# EAGLE design panel (EAGLE 9.6.2)

## Sheet 1 of 2
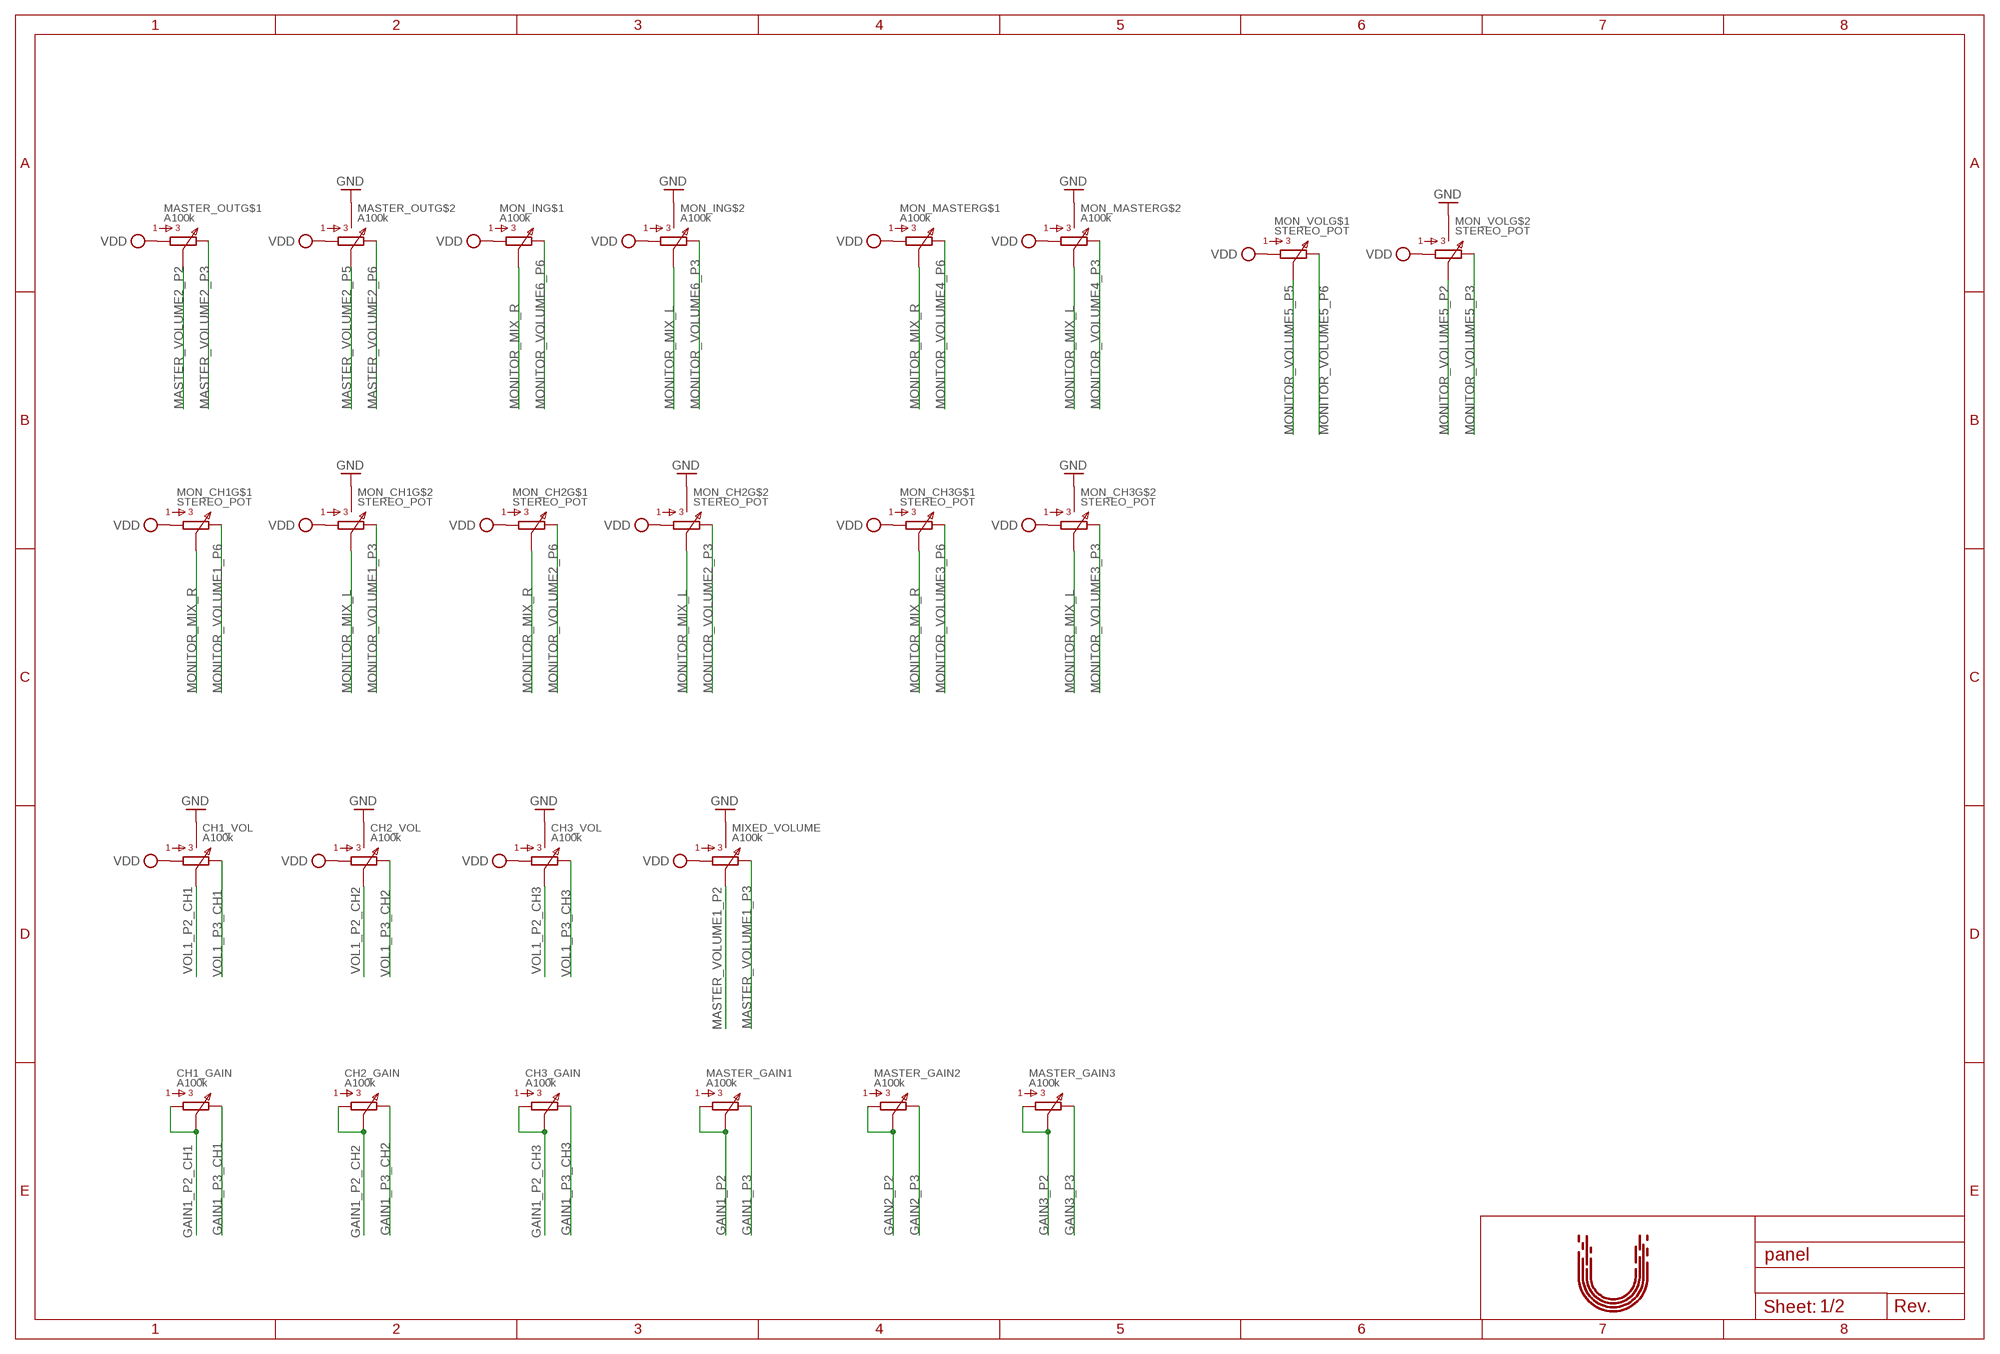
[diagram p0: schematic, sheet 1]

### Parts
CH1_GAIN  A100k  TRIMPOT  [3296W]
CH1_VOL  A100k  POT  [P0915N]
CH2_GAIN  A100k  TRIMPOT  [3296W]
CH2_VOL  A100k  POT  [P0915N]
CH3_GAIN  A100k  TRIMPOT  [3296W]
CH3_VOL  A100k  POT  [P0915N]
MASTER_GAIN1  A100k  TRIMPOT  [3296W]
MASTER_GAIN2  A100k  TRIMPOT  [3296W]
MASTER_GAIN3  A100k  TRIMPOT  [3296W]
MASTER_OUT  A100k  STEREO_POT  [P0925N]
MIXED_VOLUME  A100k  POT  [P0915N]
MON_CH1  STEREO_POT  [P0925N]
MON_CH2  STEREO_POT  [P0925N]
MON_CH3  STEREO_POT  [P0925N]
MON_IN  A100k  STEREO_POT  [P0925N]
MON_MASTER  A100k  STEREO_POT  [P0925N]
MON_VOL  STEREO_POT  [P0925N]
U$1  UTBULT_DESIGN4  [UD_4]

### Nets
GAIN1_P2: MASTER_GAIN1.P$1 MASTER_GAIN1.P$2 ; also sheet 2
GAIN1_P2_CH1: CH1_GAIN.P$1 CH1_GAIN.P$2 ; also sheet 2
GAIN1_P2_CH2: CH2_GAIN.P$1 CH2_GAIN.P$2 ; also sheet 2
GAIN1_P2_CH3: CH3_GAIN.P$1 CH3_GAIN.P$2 ; also sheet 2
GAIN1_P3: MASTER_GAIN1.P$3 ; also sheet 2
GAIN1_P3_CH1: CH1_GAIN.P$3 ; also sheet 2
GAIN1_P3_CH2: CH2_GAIN.P$3 ; also sheet 2
GAIN1_P3_CH3: CH3_GAIN.P$3 ; also sheet 2
GAIN2_P2: MASTER_GAIN2.P$1 MASTER_GAIN2.P$2 ; also sheet 2
GAIN2_P3: MASTER_GAIN2.P$3 ; also sheet 2
GAIN3_P2: MASTER_GAIN3.P$1 MASTER_GAIN3.P$2 ; also sheet 2
GAIN3_P3: MASTER_GAIN3.P$3 ; also sheet 2
GND: CH1_VOL.P$7 CH1_VOL.P$8 CH2_VOL.P$7 CH2_VOL.P$8 CH3_VOL.P$7 CH3_VOL.P$8 MASTER_OUT.P$7 MASTER_OUT.P$8 MIXED_VOLUME.P$7 MIXED_VOLUME.P$8 MON_CH1.P$7 MON_CH1.P$8 MON_CH2.P$7 MON_CH2.P$8 MON_CH3.P$7 MON_CH3.P$8 MON_IN.P$7 MON_IN.P$8 MON_MASTER.P$7 MON_MASTER.P$8 MON_VOL.P$7 MON_VOL.P$8 ; also sheet 2
MASTER_VOLUME1_P2: MIXED_VOLUME.P$2 ; also sheet 2
MASTER_VOLUME1_P3: MIXED_VOLUME.P$3 ; also sheet 2
MASTER_VOLUME2_P2: MASTER_OUT.P$2 ; also sheet 2
MASTER_VOLUME2_P3: MASTER_OUT.P$3 ; also sheet 2
MASTER_VOLUME2_P5: MASTER_OUT.P$5 ; also sheet 2
MASTER_VOLUME2_P6: MASTER_OUT.P$6 ; also sheet 2
MONITOR_MIX_L: MON_CH1.P$5 MON_CH2.P$5 MON_CH3.P$5 MON_IN.P$5 MON_MASTER.P$5 ; also sheet 2
MONITOR_MIX_R: MON_CH1.P$2 MON_CH2.P$2 MON_CH3.P$2 MON_IN.P$2 MON_MASTER.P$2 ; also sheet 2
MONITOR_VOLUME1_P3: MON_CH1.P$6 ; also sheet 2
MONITOR_VOLUME1_P6: MON_CH1.P$3 ; also sheet 2
MONITOR_VOLUME2_P3: MON_CH2.P$6 ; also sheet 2
MONITOR_VOLUME2_P6: MON_CH2.P$3 ; also sheet 2
MONITOR_VOLUME3_P3: MON_CH3.P$6 ; also sheet 2
MONITOR_VOLUME3_P6: MON_CH3.P$3 ; also sheet 2
MONITOR_VOLUME4_P3: MON_MASTER.P$6 ; also sheet 2
MONITOR_VOLUME4_P6: MON_MASTER.P$3 ; also sheet 2
MONITOR_VOLUME5_P2: MON_VOL.P$5 ; also sheet 2
MONITOR_VOLUME5_P3: MON_VOL.P$6 ; also sheet 2
MONITOR_VOLUME5_P5: MON_VOL.P$2 ; also sheet 2
MONITOR_VOLUME5_P6: MON_VOL.P$3 ; also sheet 2
MONITOR_VOLUME6_P3: MON_IN.P$6 ; also sheet 2
MONITOR_VOLUME6_P6: MON_IN.P$3 ; also sheet 2
VDD: CH1_VOL.P$1 CH2_VOL.P$1 CH3_VOL.P$1 MASTER_OUT.P$1 MASTER_OUT.P$4 MIXED_VOLUME.P$1 MON_CH1.P$1 MON_CH1.P$4 MON_CH2.P$1 MON_CH2.P$4 MON_CH3.P$1 MON_CH3.P$4 MON_IN.P$1 MON_IN.P$4 MON_MASTER.P$1 MON_MASTER.P$4 MON_VOL.P$1 MON_VOL.P$4 ; also sheet 2
VOL1_P2_CH1: CH1_VOL.P$2 ; also sheet 2
VOL1_P2_CH2: CH2_VOL.P$2 ; also sheet 2
VOL1_P2_CH3: CH3_VOL.P$2 ; also sheet 2
VOL1_P3_CH1: CH1_VOL.P$3 ; also sheet 2
VOL1_P3_CH2: CH2_VOL.P$3 ; also sheet 2
VOL1_P3_CH3: CH3_VOL.P$3 ; also sheet 2

## Sheet 2 of 2: Headers
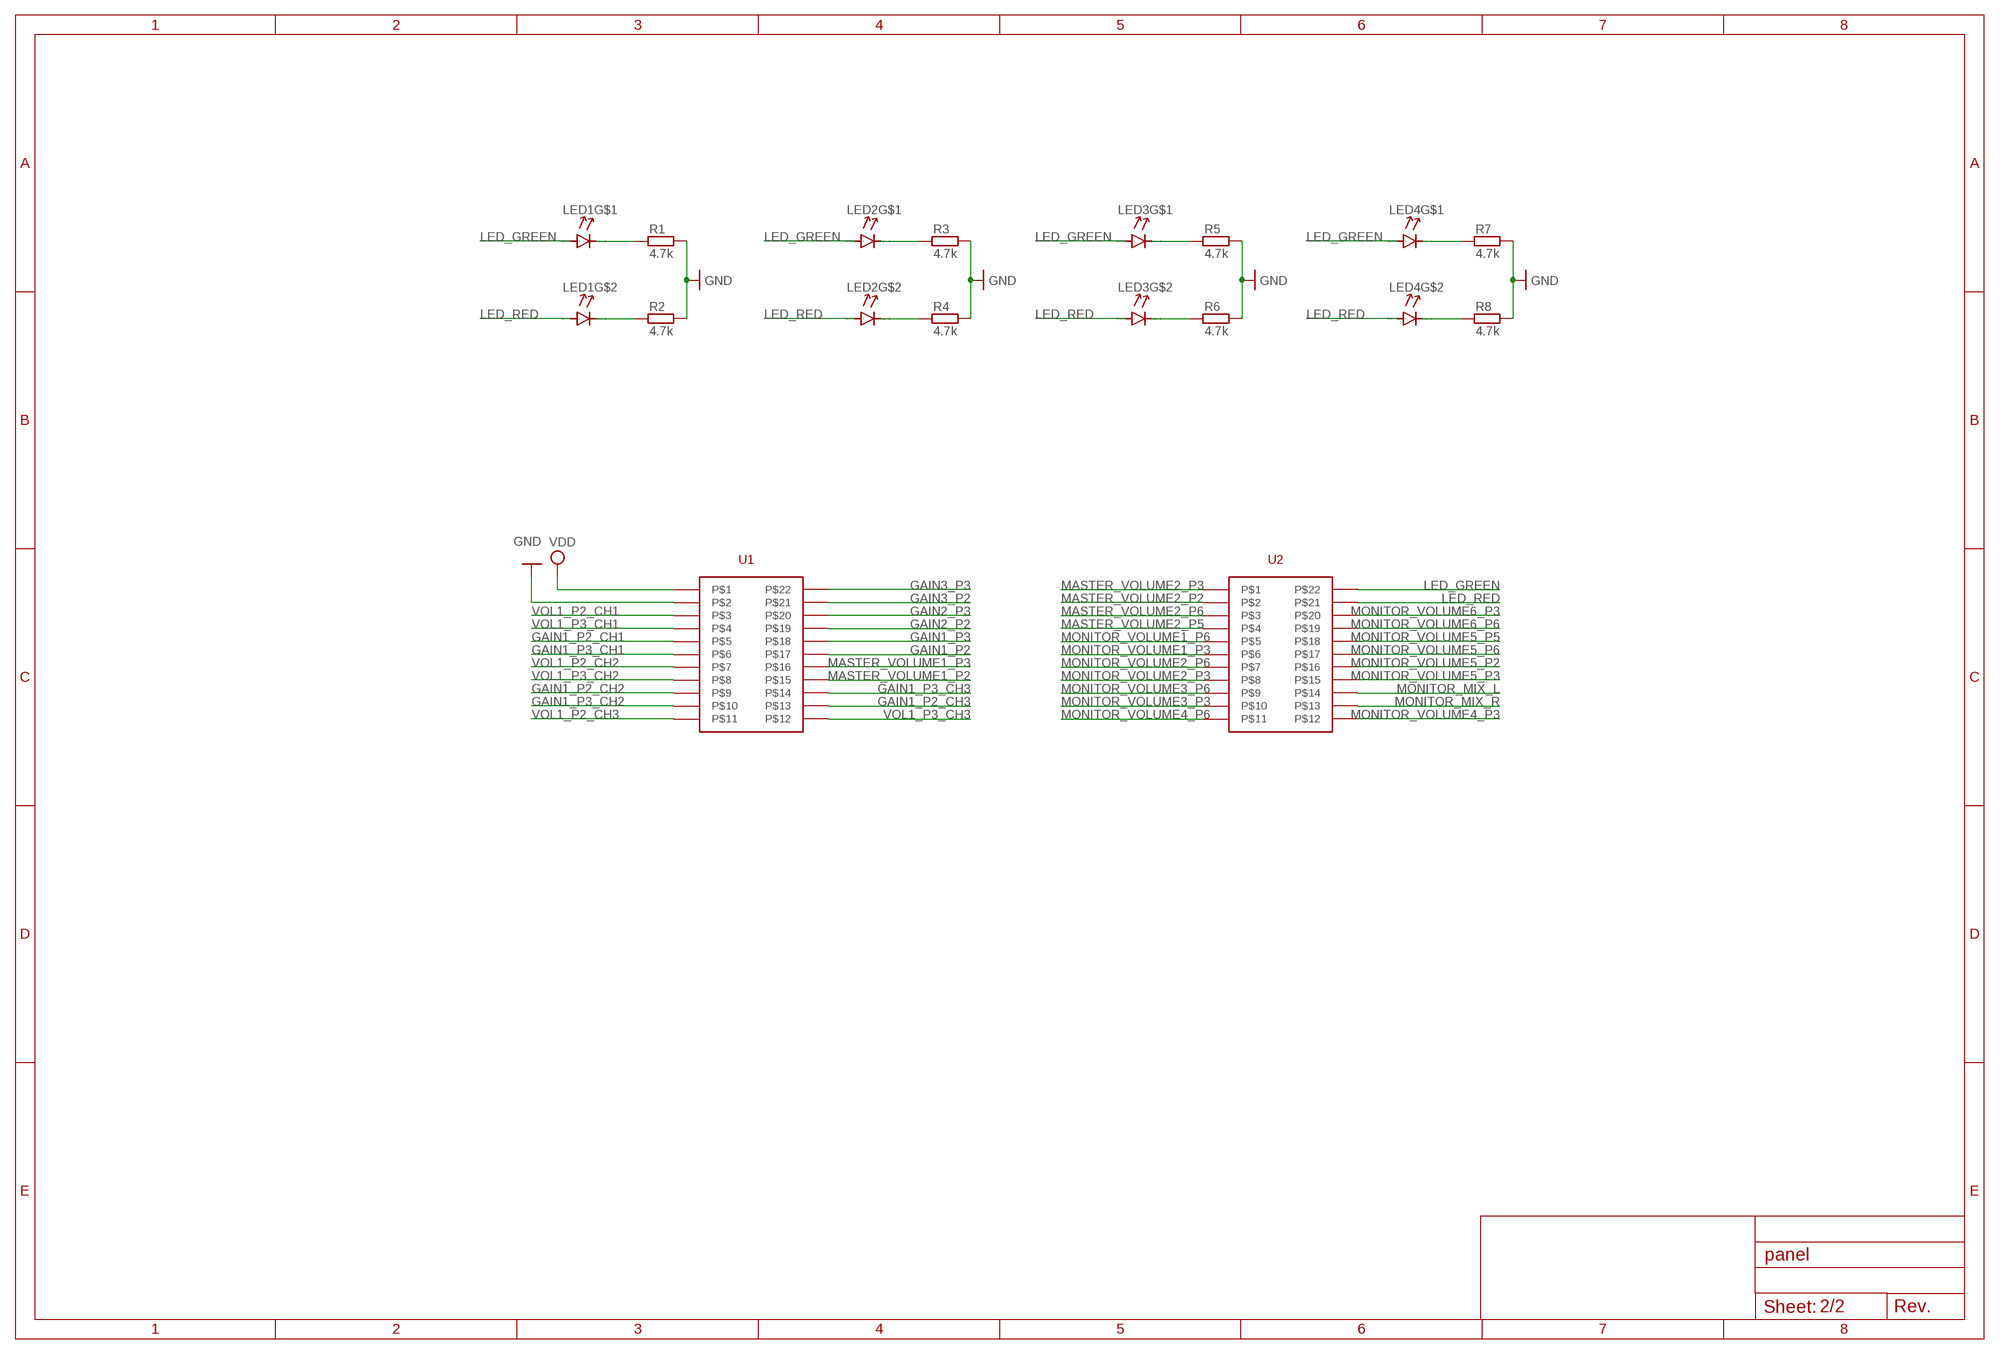
[diagram p1: schematic, sheet 2]

### Parts
LED1  DUAL_LEDDUAL_LED  [RESCAXE40P80X160X50-4N]
LED2  DUAL_LEDDUAL_LED  [RESCAXE40P80X160X50-4N]
LED3  DUAL_LEDDUAL_LED  [RESCAXE40P80X160X50-4N]
LED4  DUAL_LEDDUAL_LED  [RESCAXE40P80X160X50-4N]
R1  4.7k  RESISTOR  [R0603]
R2  4.7k  RESISTOR  [R0603]
R3  4.7k  RESISTOR  [R0603]
R4  4.7k  RESISTOR  [R0603]
R5  4.7k  RESISTOR  [R0603]
R6  4.7k  RESISTOR  [R0603]
R7  4.7k  RESISTOR  [R0603]
R8  4.7k  RESISTOR  [R0603]
U1  22PINHEADER22PINHEADER  [HDRV22W64P254_2X11_2794X508X838B]
U2  22PINHEADER22PINHEADER  [HDRV22W64P254_2X11_2794X508X838B]

### Nets
GAIN1_P2: U1.17 ; also sheet 1
GAIN1_P2_CH1: U1.5 ; also sheet 1
GAIN1_P2_CH2: U1.9 ; also sheet 1
GAIN1_P2_CH3: U1.13 ; also sheet 1
GAIN1_P3: U1.18 ; also sheet 1
GAIN1_P3_CH1: U1.6 ; also sheet 1
GAIN1_P3_CH2: U1.10 ; also sheet 1
GAIN1_P3_CH3: U1.14 ; also sheet 1
GAIN2_P2: U1.19 ; also sheet 1
GAIN2_P3: U1.20 ; also sheet 1
GAIN3_P2: U1.21 ; also sheet 1
GAIN3_P3: U1.22 ; also sheet 1
GND: R1.2 R2.2 R3.2 R4.2 R5.2 R6.2 R7.2 R8.2 U1.2 ; also sheet 1
LED_GREEN: LED1.1(A) LED2.1(A) LED3.1(A) LED4.1(A) U2.22
LED_RED: LED1.2(A) LED2.2(A) LED3.2(A) LED4.2(A) U2.21
MASTER_VOLUME1_P2: U1.15 ; also sheet 1
MASTER_VOLUME1_P3: U1.16 ; also sheet 1
MASTER_VOLUME2_P2: U2.2 ; also sheet 1
MASTER_VOLUME2_P3: U2.1 ; also sheet 1
MASTER_VOLUME2_P5: U2.4 ; also sheet 1
MASTER_VOLUME2_P6: U2.3 ; also sheet 1
MONITOR_MIX_L: U2.14 ; also sheet 1
MONITOR_MIX_R: U2.13 ; also sheet 1
MONITOR_VOLUME1_P3: U2.6 ; also sheet 1
MONITOR_VOLUME1_P6: U2.5 ; also sheet 1
MONITOR_VOLUME2_P3: U2.8 ; also sheet 1
MONITOR_VOLUME2_P6: U2.7 ; also sheet 1
MONITOR_VOLUME3_P3: U2.10 ; also sheet 1
MONITOR_VOLUME3_P6: U2.9 ; also sheet 1
MONITOR_VOLUME4_P3: U2.12 ; also sheet 1
MONITOR_VOLUME4_P6: U2.11 ; also sheet 1
MONITOR_VOLUME5_P2: U2.16 ; also sheet 1
MONITOR_VOLUME5_P3: U2.15 ; also sheet 1
MONITOR_VOLUME5_P5: U2.18 ; also sheet 1
MONITOR_VOLUME5_P6: U2.17 ; also sheet 1
MONITOR_VOLUME6_P3: U2.20 ; also sheet 1
MONITOR_VOLUME6_P6: U2.19 ; also sheet 1
N$1: LED1.4(C) R1.1
N$2: LED1.3(C) R2.1
N$3: LED2.4(C) R3.1
N$4: LED2.3(C) R4.1
N$5: LED3.4(C) R5.1
N$6: LED3.3(C) R6.1
N$7: LED4.4(C) R7.1
N$8: LED4.3(C) R8.1
VDD: U1.1 ; also sheet 1
VOL1_P2_CH1: U1.3 ; also sheet 1
VOL1_P2_CH2: U1.7 ; also sheet 1
VOL1_P2_CH3: U1.11 ; also sheet 1
VOL1_P3_CH1: U1.4 ; also sheet 1
VOL1_P3_CH2: U1.8 ; also sheet 1
VOL1_P3_CH3: U1.12 ; also sheet 1

## Library data of the parts
CH1_GAIN CH2_GAIN CH3_GAIN MASTER_GAIN1-MASTER_GAIN3 = lib:TRIMPOT: Trim pot Trimmer Resistors - Through Hole 3/8" 100Kohms Sealed Vertical Adjust; LINK: https://www.mouser.se/ProductDetail/Bourns/3296W-1-104RLF?qs=L51TDuM0cPDJlywbd0t8jQ%3D%3D; MOUSERNR: 652-3296W-1-104RLF; MPN: 3296W-1-104RLF; SUPPLIER: Mouser
CH1_VOL CH2_VOL CH3_VOL MIXED_VOLUME = lib:POT: Potentiometer Potentiometers 1/40W 100K Ohms 20% 9mm ROTARY POT; LINK: https://www.mouser.se/ProductDetail/BI-Technologies-TT-Electronics/P0915N-QC15AR100K?qs=xIkB7y1OTopi6Zs8qG7IZg%3D%3D; MOUSERNR: 858-P0915NQC15AR100K; MPN: P0915N-QC15AR100K; SUPPLIER: Mouser
LED1-LED4 = lib:DUAL_LED: Dual Led Standard LEDs - SMD Red/Amber Bi-Color; LINK: https://www.mouser.se/ProductDetail/Broadcom-Avago/HSMF-C162?qs=9%2FrGSQZ%252Bqoid0PR%252B7Tavrg%3D%3D; MOUSERNR: 630-HSMF-C162; MPN: HSMF-C162; SUPPLIER: Mouser
MASTER_OUT MON_CH1-MON_CH3 MON_IN MON_MASTER MON_VOL = lib:STEREO_POT: Stereo Pot Potentiometers 1/40W 100K Ohms 20% 9mm ROTARY POT; LINK: https://www.mouser.se/ProductDetail/BI-Technologies-TT-Electronics/P0925N-FC20AR100K?qs=56eeD6vBg8iu%252BaH%2FeiwqGQ%3D%3D; MOUSERNR: 858-P0925NFC20AR100K; MPN: P0925N-FC20AR100K; SUPPLIER: Mouser
R1-R8 = lib:RESISTOR
U1 U2 = lib:22PINHEADER
U$1 = lib:UTBULT_DESIGN

## Board
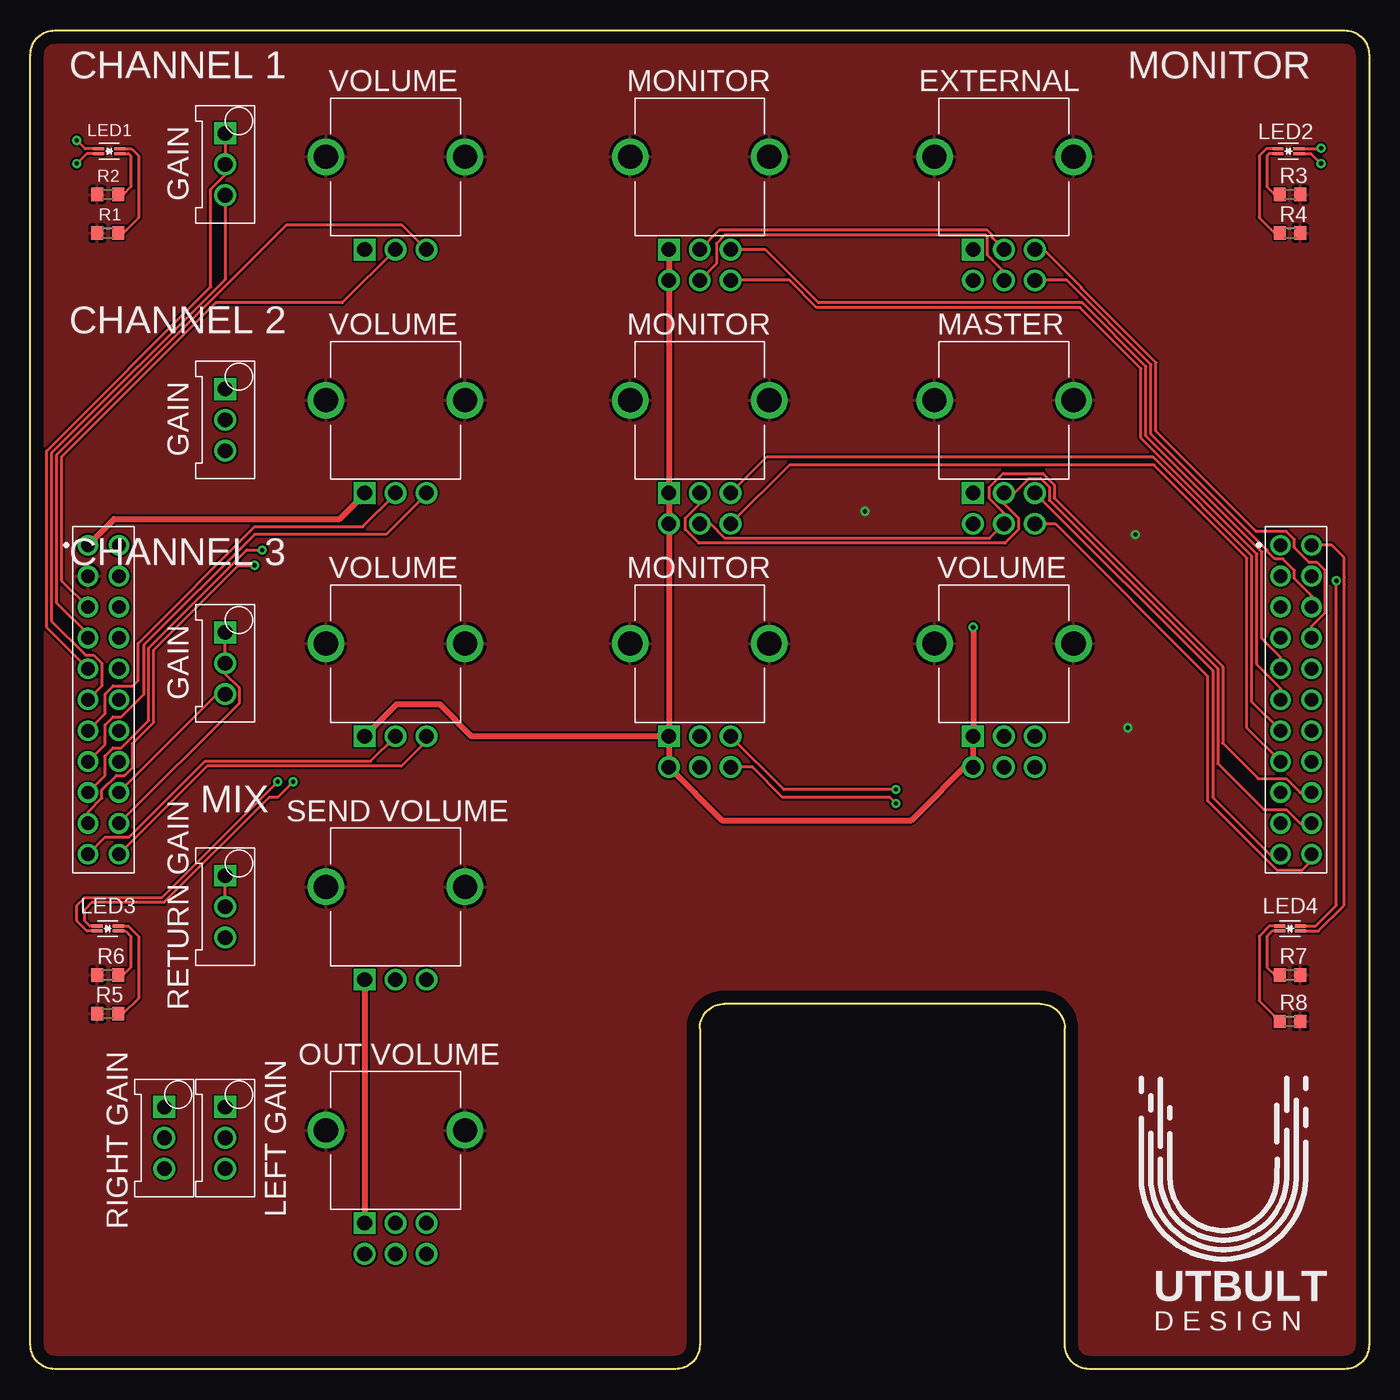
[diagram p2: board, top side]
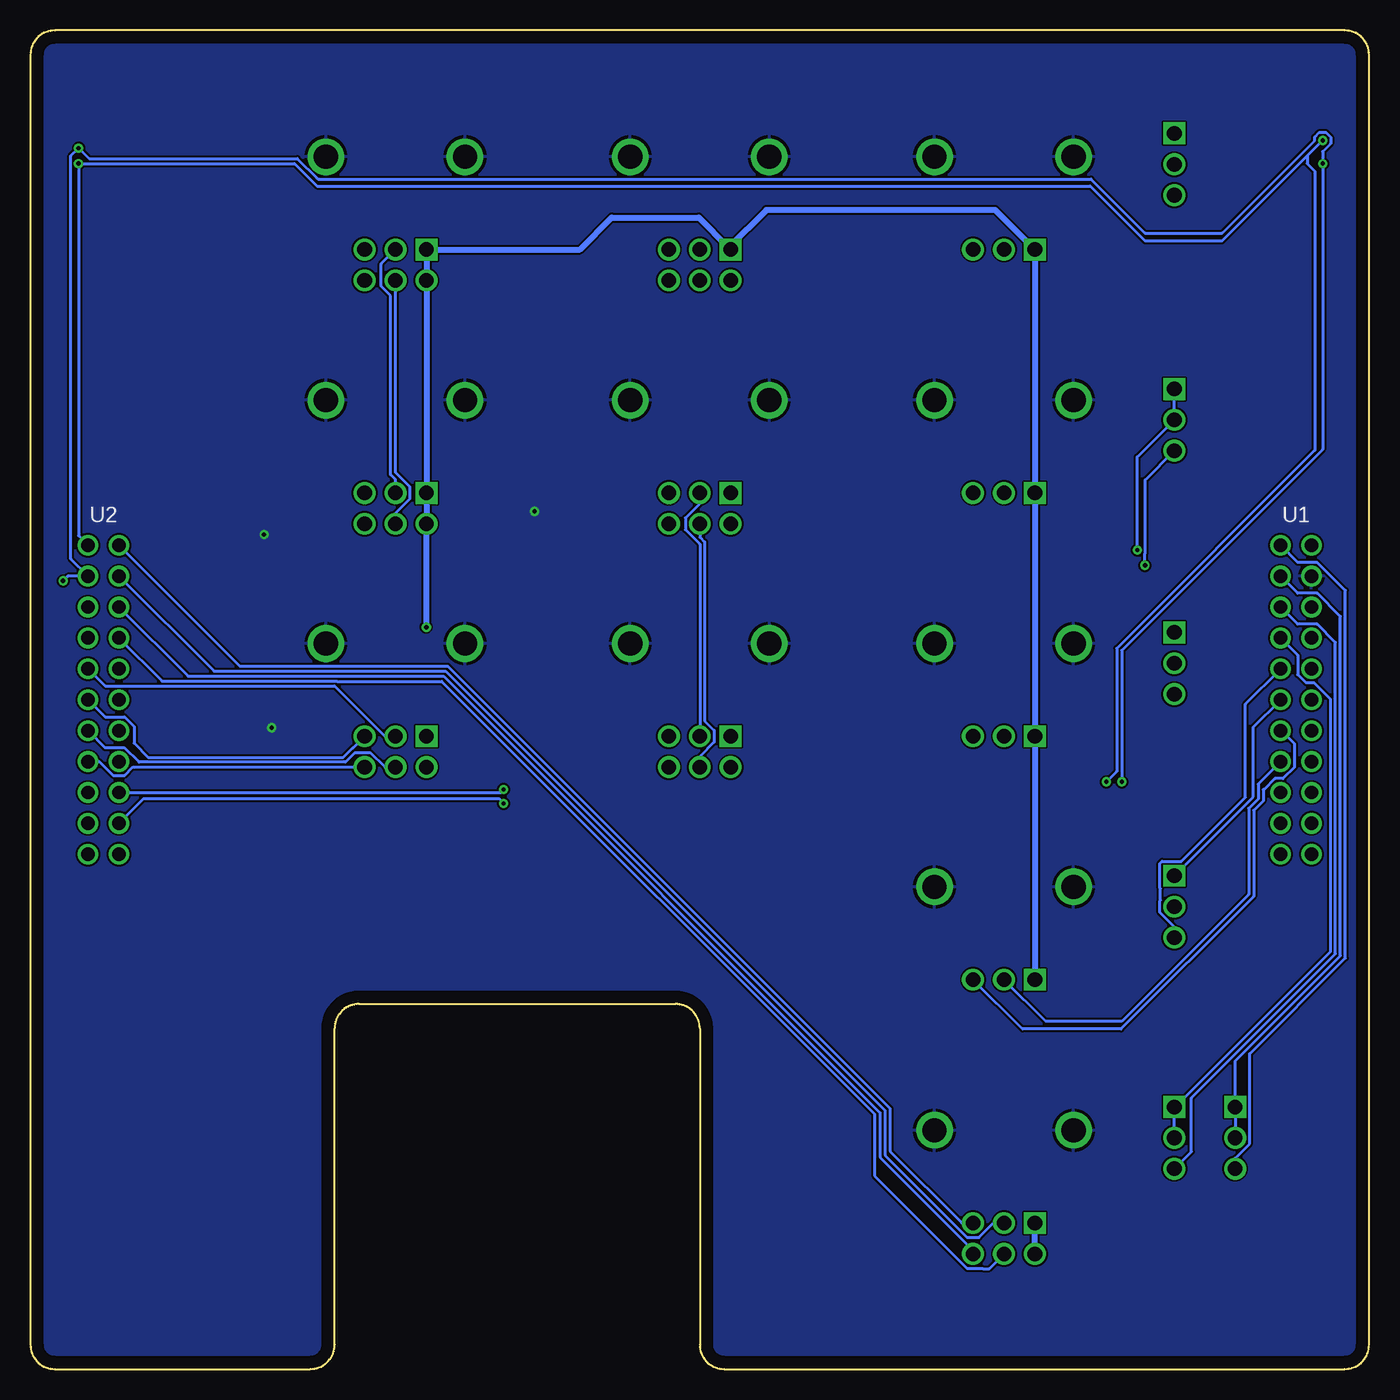
[diagram p3: board, bottom side, seen from below]

Size 110 x 110 mm. Coordinates in mm from the lower left corner, seen from the top.
Outline: 0,2 0,108 arc-90 2,110 108,110 arc-90 110,108 110,2 arc-90 108,0 87,0 arc-90 85,2 85,28 arc90 83,30 57,30 arc90 55,28 55,2 arc-90 53,0 2,0 arc-90 0,2
Copper layers (1*16): Top 0.035mm / dielectric 1.5mm / Bottom 0.035mm
Design rules "default": minimum track width 6mil, minimum drill 0.35mm, track to track 6mil, track to pad 6mil, pad to pad 6mil, via to via 6mil, smd to smd 6mil, copper to edge 40mil, drill to drill 6mil, minimum pad ring 10mil, minimum via ring 8mil, stop-mask expansion 4mil, vias tented up to drill 0mil, thermal gap 10mil

### Footprints (pad centres in the part's own frame; a part is rotated, then mirrored left to right if it is on the bottom)
3296W = drill 1.2 square: P$1 -2.54,0 | drill 1.2: P$2 0,0; P$3 2.54,0
P0915N = drill 1.2 square: P$1 -2.54,0 | drill 1.2: P$2 0,0; P$3 2.54,0 | drill 2: P$7 -5.715,7.62; P$8 5.715,7.62
RESCAXE40P80X160X50-4N = smd 0.89 x 0.26: 1 -0.855,0.2; 2 -0.855,-0.2; 3 0.855,-0.2; 4 0.855,0.2
P0925N = drill 1.2 square: P$1 -2.54,0 | drill 1.2: P$2 0,0; P$3 2.54,0; P$4 -2.54,-2.54; P$5 0,-2.54; P$6 2.54,-2.54 | drill 2: P$7 -5.715,7.62; P$8 5.715,7.62
R0603 = smd 1 x 1.1: 1 -0.85,0; 2 0.85,0
HDRV22W64P254_2X11_2794X508X838B = drill 1.105 pad 1.705: 1 -12.7,-1.27; 2 -10.16,-1.27; 3 -7.62,-1.27; 4 -5.08,-1.27; 5 -2.54,-1.27; 6 0,-1.27; 7 2.54,-1.27; 8 5.08,-1.27; 9 7.62,-1.27; 10 10.16,-1.27; 11 12.7,-1.27; 12 12.7,1.27; 13 10.16,1.27; 14 7.62,1.27; 15 5.08,1.27; 16 2.54,1.27; 17 0,1.27; 18 -2.54,1.27; 19 -5.08,1.27; 20 -7.62,1.27; 21 -10.16,1.27; 22 -12.7,1.27

### Placement (x,y rotation side)
CH1_GAIN  16,99 270 top
CH1_VOL  30,92 0 top
CH2_GAIN  16,78 270 top
CH2_VOL  30,72 0 top
CH3_GAIN  16,58 270 top
CH3_VOL  30,52 0 top
LED1  6.48,100.08 0 top
LED2  103.38,100.08 180 top
LED3  6.35,36.2 0 top
LED4  103.5,36.2 180 top
MASTER_GAIN1  16,38 270 top
MASTER_GAIN2  16,19 270 top
MASTER_GAIN3  11,19 270 top
MASTER_OUT  30,12 0 top
MIXED_VOLUME  30,32 0 top
MON_CH1  55,92 0 top
MON_CH2  55,72 0 top
MON_CH3  55,52 0 top
MON_IN  80,92 0 top
MON_MASTER  80,72 0 top
MON_VOL  80,52 0 top
R1  6.35,93.34 180 top
R2  6.35,96.52 180 top
R3  103.5,96.52 0 top
R4  103.5,93.34 0 top
R5  6.35,29.21 180 top
R6  6.35,32.38 180 top
R7  103.5,32.38 0 top
R8  103.5,28.57 0 top
U1  6,55 270 top
U2  104,55 270 top
U$1  98,17 0 top

### Tracks (layer width: path | path; a pad name or v marks a point on that pad's centre or on a via)
GAIN1_P2
  Top 0.254: MASTER_GAIN1.P$2 MASTER_GAIN1.P$1
  Bottom 0.254: MASTER_GAIN1.P$1 9.53,47.02 9.53,52.74 U1.17
GAIN1_P2_CH1
  Top 0.254: CH1_GAIN.P$1 CH1_GAIN.P$2 16,98.13 14.82,96.95 14.82,88.94 1.32,75.44 1.32,60.95 U1.5
GAIN1_P2_CH2  (via drill 0.35)
  Top 0.254: U1.9 6.14,48.79 6.14,50.39 6.8,51.05 7.46,51.05 9.73,53.32 9.73,59.26 17.78,67.31 v19.05,67.31
  Bottom 0.254: v19.05,67.31 19.05,74.95 CH2_GAIN.P$2 CH2_GAIN.P$1
GAIN1_P2_CH3
  Top 0.254: U1.13 17.18,54.75 17.18,55.95 16,57.13 CH3_GAIN.P$2 CH3_GAIN.P$1
GAIN1_P3
  Bottom 0.254: MASTER_GAIN1.P$3 16,36.33 17.18,37.51 17.18,38.49 17.14,38.52 17.14,39.49 17.18,39.52 17.18,41.56 17.02,41.72 15.43,41.72 10.16,46.99 10.16,54.65 U1.18
GAIN1_P3_CH1
  Top 0.254: CH1_GAIN.P$3 16,89.54 1.73,75.27 1.73,61.48 4.54,58.67 5.2,58.67 5.86,58.01 5.86,56.13 U1.6
GAIN1_P3_CH2  (via drill 0.35)
  Top 0.254: U1.10 4.73,45.78 5.86,46.91 5.86,47.57 7.08,48.79 7.74,48.79 8.4,49.45 8.4,51.42 10.13,53.15 10.13,59.09 17.09,66.04 v18.41,66.04
  Bottom 0.254: v18.41,66.04 18.41,67.02 18.39,67.04 18.39,73.07 CH2_GAIN.P$3
GAIN1_P3_CH3
  Top 0.254: U1.14 15.35,55.46 CH3_GAIN.P$3
GAIN2_P2
  Bottom 0.254: U1.19 5.86,58.67 5.86,57.07 5.2,56.41 4.54,56.41 3.17,55.05 3.17,34.29 16.51,20.95 16.51,21.03 16.23,21.31 | 16.23,21.31 MASTER_GAIN2.P$1 | MASTER_GAIN2.P$2 16,21.08 16.23,21.31
GAIN2_P3
  Bottom 0.254: MASTER_GAIN2.P$3 14.61,17.86 14.61,22.29 2.77,34.12 2.77,59.72 4.26,61.21 5.86,61.21 U1.20
GAIN3_P2
  Bottom 0.254: MASTER_GAIN3.P$2 MASTER_GAIN3.P$1 11,25.32 2.36,33.95 2.36,61.85 4.26,63.75 5.86,63.75 U1.21
GAIN3_P3
  Bottom 0.254: MASTER_GAIN3.P$3 11,17.33 9.82,18.51 9.82,25.92 1.96,33.78 1.96,63.99 4.26,66.29 5.86,66.29 U1.22
GND  (via drill 0.35)
  other vias: 68.58,70.48 90.81,68.58 90.17,52.7
  pour Bottom: 0,110.49 109.86,110.49 109.86,0 0,0
  pour Top: 0,110.49 109.86,110.49 109.86,0 0,0
LED_GREEN  (via drill 0.35)
  Top 0.254: LED4.1 105.84,35.99 107.95,38.1 107.95,64.47 107.97,64.5 107.97,65.04 107.95,65.06 107.95,66.67 106.92,67.7 U2.22 | LED2.1 105.23,99.88 v106.05,99.06 | LED1.1 4.5,100.28 v3.81,100.97 | v21.59,48.26 20.32,46.99 19.62,46.99 10.96,38.33 5.05,38.33 4.45,37.72 4.45,36.83 4.88,36.4 LED3.1
  Bottom 0.254: U2.22 106.05,68.47 v106.05,99.06 88.31,99.06 86.45,97.21 22.91,97.21 18.41,92.71 12.06,92.71 5.08,99.69 | 5.08,99.69 v3.81,100.97 | 5.08,99.69 5.08,99.06 4.45,98.42 4.45,75.5 20.73,59.22 20.73,49.12 v21.59,48.26
LED_RED  (via drill 0.35)
  Top 0.254: v107.31,64.77 107.31,38.1 105.61,36.4 LED4.2 | 106,100.28 v106.05,100.33 105.99,100.28 LED2.2 | LED1.2 4.63,99.88 v3.81,99.06 | v20.32,48.26 10.79,38.73 4.45,38.73 3.81,38.1 3.81,36.83 4.64,35.99 LED3.2
  Bottom 0.254: v107.31,64.77 106.92,65.16 U2.21 106.68,66.57 106.68,99.69 v106.05,100.33 105.18,99.47 88.08,99.47 86.45,97.84 86.41,97.84 86.36,97.79 22.86,97.79 18.41,93.34 12.06,93.34 4.47,100.94 4.47,101.24 4.08,101.62 3.54,101.62 3.15,101.24 3.15,100.69 3.81,100.03 v3.81,99.06 3.81,75.56 20.32,59.05 v20.32,48.26
MASTER_VOLUME1_P2
  Bottom 0.254: U1.15 9.12,48.07 9.12,46.85 9.88,46.08 9.88,39.01 20.32,28.57 26.57,28.57 MIXED_VOLUME.P$2
MASTER_VOLUME1_P3
  Bottom 0.254: U1.16 7.19,52.46 6.14,51.41 6.14,49.45 7.08,48.51 7.74,48.51 8.63,47.62 8.71,47.62 8.71,46.68 9.48,45.91 9.48,38.84 20.38,27.94 28.48,27.94 MIXED_VOLUME.P$3
MASTER_VOLUME2_P2
  Bottom 0.254: U2.2 94.92,57.35 75.89,57.35 39.78,21.24 39.78,17.57 33.03,10.82 32.05,10.82 30.87,12 MASTER_OUT.P$2
MASTER_VOLUME2_P3
  Bottom 0.254: U2.1 92.79,57.76 75.72,57.76 39.37,21.41 39.37,17.91 33.46,12 MASTER_OUT.P$3
MASTER_VOLUME2_P5
  Bottom 0.254: U2.4 99.19,56.54 84.84,56.54 84.81,56.52 76.2,56.52 40.64,20.95 40.64,15.89 33.03,8.28 31.78,8.28 31.75,8.26 31.2,8.26 MASTER_OUT.P$5
MASTER_VOLUME2_P6
  Bottom 0.254: U2.3 97.06,56.95 76.06,56.95 40.18,21.07 40.18,17.4 32.54,9.76 MASTER_OUT.P$6
MONITOR_MIX_L
  Top 0.254: U2.14 104.33,47.38 103.2,48.51 100.89,48.51 97.97,51.44 97.97,57.72 84.13,71.56 84.13,72.66 83.2,73.59 79.92,73.59 78.82,72.49 78.82,71.51 80,70.33 MON_MASTER.P$5 78.82,68.28 57.05,68.28 55.87,69.46 MON_CH2.P$5 | MON_IN.P$5 80,90.18 78.64,91.54 78.64,93.02 78.48,93.18 57.05,93.18 56.36,92.49 56.36,90.82 MON_CH1.P$5
  Bottom 0.254: MON_MASTER.P$5 80,70.33 78.82,71.51 78.82,72.49 80,73.67 MON_IN.P$5 | MON_CH2.P$5 55,68.37 54.59,67.96 54.59,53.26 53.82,52.49 53.82,51.51 55,50.33 MON_CH3.P$5
MONITOR_MIX_R
  Top 0.254: U2.13 104.33,44.84 103.2,45.97 101.35,45.97 97.56,49.76 97.56,57.55 83.72,71.39 83.72,72.49 83.03,73.18 82.05,73.18 80.87,72 MON_MASTER.P$2 80,71.13 81.18,69.95 81.18,68.97 80.08,67.87 54.92,67.87 53.82,68.97 53.82,69.95 55,71.13 MON_CH2.P$2 | MON_IN.P$2 79.05,92.95 79.05,93.18 78.64,93.59 56.59,93.59 MON_CH1.P$2
  Bottom 0.254: MON_MASTER.P$2 80,73.09 80.41,73.5 80.41,88.2 81.18,88.97 81.18,90.82 MON_IN.P$2 | MON_CH2.P$2 55,71.13 56.18,69.95 56.18,68.97 55,67.79 MON_CH3.P$2
MONITOR_VOLUME1_P3
  Top 0.254: U2.6 102.73,55.94 100.78,57.88 100.78,66.97 91.26,76.5 91.26,82.21 86.25,87.22 64.6,87.22 62.37,89.46 MON_CH1.P$6
MONITOR_VOLUME1_P6
  Top 0.254: U2.5 102.73,58.48 101.19,60.02 101.19,67.14 91.67,76.67 91.67,82.38 86.42,87.63 64.77,87.63 60.4,92 MON_CH1.P$3
MONITOR_VOLUME2_P3
  Top 0.254: U2.8 99.97,52.68 99.97,66.64 92.32,74.3 62.38,74.3 MON_CH2.P$6
MONITOR_VOLUME2_P6
  Top 0.254: U2.7 100.38,54.81 100.38,66.81 92.26,74.93 60.47,74.93 MON_CH2.P$3
MONITOR_VOLUME3_P3  (via drill 0.35)
  Top 0.254: v71.12,46.48 70.61,46.99 61.79,46.99 59.32,49.46 MON_CH3.P$6
  Bottom 0.254: U2.10 100.7,46.87 71.51,46.87 v71.12,46.48
MONITOR_VOLUME3_P6  (via drill 0.35)
  Top 0.254: v71.12,47.62 61.91,47.62 MON_CH3.P$3
  Bottom 0.254: U2.9 71.36,47.38 v71.12,47.62
MONITOR_VOLUME4_P3
  Top 0.254: MON_MASTER.P$6 84.21,69.46 96.75,56.92 96.75,46.68 102.47,40.96 104.46,40.96 105.27,41.77 U2.12
MONITOR_VOLUME4_P6
  Top 0.254: MON_MASTER.P$3 97.16,57.38 97.16,46.99 101.84,42.3 U2.11
MONITOR_VOLUME5_P2
  Bottom 0.254: U2.16 103.86,51.05 102.26,51.05 101.08,49.87 84.12,49.87 83.35,50.64 82.05,50.64 80.87,49.46 MON_VOL.P$5
MONITOR_VOLUME5_P3
  Bottom 0.254: U2.15 104.33,49.92 103.2,48.79 102.26,48.79 101.59,49.46 MON_VOL.P$6
MONITOR_VOLUME5_P5
  Bottom 0.254: U2.18 103.86,56.13 85,56.13 80.87,52 MON_VOL.P$2
MONITOR_VOLUME5_P6
  Bottom 0.254: U2.17 103.86,53.59 102.26,53.59 101.49,52.82 101.49,51.43 100.33,50.27 84.29,50.27 83.51,51.05 83.49,51.05 MON_VOL.P$3
MONITOR_VOLUME6_P3
  Top 0.254: U2.20 105.27,63.56 103.86,64.97 103.86,65.63 102.92,66.57 102.26,66.57 101.6,67.23 101.6,67.31 92.08,76.83 92.08,82.55 85.17,89.46 MON_IN.P$6
MONITOR_VOLUME6_P6
  Top 0.254: U2.19 105.27,61.02 106.4,62.15 106.4,65.63 105.74,66.29 105.08,66.29 103.86,67.51 103.86,68.17 103.2,68.83 100.71,68.83 92.48,77.06 92.48,82.72 86.36,88.84 86.36,88.9 83.26,92 MON_IN.P$3
N$1
  Top 0.254: LED1.4 8.31,100.28 8.89,99.69 8.89,94.61 7.62,93.34 R1.1
N$2
  Top 0.254: LED1.3 8.07,99.88 8.26,99.69 8.26,97.16 7.62,96.52 R2.1
N$3
  Top 0.254: LED2.4 101.78,99.88 101.6,99.69 101.6,97.16 102.23,96.52 R3.1
N$4
  Top 0.254: LED2.3 101.55,100.28 100.97,99.69 100.97,94.61 102.23,93.34 R4.1
N$5
  Top 0.254: LED3.4 8.05,36.4 8.89,35.56 8.89,30.48 7.62,29.21 R5.1
N$6
  Top 0.254: LED3.3 7.82,35.99 8.26,35.56 8.26,33.02 7.62,32.38 R6.1
N$7
  Top 0.254: LED4.4 102.03,35.99 101.6,35.56 101.6,33.02 102.23,32.38 R7.1
N$8
  Top 0.254: LED4.3 101.8,36.4 100.97,35.56 100.97,30.27 R8.1
VDD  (via drill 0.35)
  Top 0.508: U1.1 6.88,69.85 25.4,69.85 27.94,72.39 27.85,72.39 CH2_VOL.P$1 | MIXED_VOLUME.P$1 MASTER_OUT.P$1 | 52.07,52 MON_CH3.P$1 MON_CH3.P$4 56.84,45.09 72.39,45.09 77.46,50.16 | 52.07,52 36.27,52 33.66,54.61 30.07,54.61 CH3_VOL.P$1 | MON_CH1.P$1 MON_CH1.P$4 MON_CH2.P$1 MON_CH2.P$4 52.46,52.39 52.07,52 | v77.47,60.96 MON_VOL.P$1 77.46,50.16 | 77.46,50.16 MON_VOL.P$4
  Bottom 0.508: MASTER_OUT.P$4 MASTER_OUT.P$1 | MIXED_VOLUME.P$1 CH3_VOL.P$1 CH2_VOL.P$1 CH1_VOL.P$1 30.71,95.25 49.53,95.25 52.62,92.16 | v77.47,60.96 MON_MASTER.P$4 MON_MASTER.P$1 MON_IN.P$4 MON_IN.P$1 64.84,92 62.23,94.61 55.08,94.61 52.62,92.16 | 52.62,92.16 MON_CH1.P$1
VOL1_P2_CH1
  Top 0.254: CH1_VOL.P$2 25.63,87.63 15.24,87.63 2.54,74.93 2.54,64.81 U1.3
VOL1_P2_CH2
  Top 0.254: U1.7 6.14,53.87 6.14,55.47 6.8,56.13 8.4,56.13 8.84,56.57 8.84,59.64 18.41,69.22 27.3,69.22 30,71.91 CH2_VOL.P$2
VOL1_P2_CH3
  Top 0.254: U1.11 6.14,43.71 8.1,43.71 14.35,49.96 27.96,49.96 CH3_VOL.P$2
VOL1_P3_CH1
  Top 0.254: CH1_VOL.P$3 30.56,93.98 21.02,93.98 2.13,75.1 2.13,62.98 4.73,60.38 U1.4
VOL1_P3_CH2
  Top 0.254: U1.8 6.14,51.33 6.14,52.93 6.8,53.59 7.46,53.59 9.32,55.45 9.32,59.48 18.41,68.58 29.21,68.58 32.63,72 CH2_VOL.P$3
VOL1_P3_CH3
  Top 0.254: CH3_VOL.P$3 32.54,51.6 30.49,49.55 14.52,49.55 U1.12

### Text on the board
tPlace: EXTERNAL | MASTER | VOLUME
tNames: CHANNEL 1 | MONITOR | VOLUME | MONITOR | GAIN | CHANNEL 2 | VOLUME | MONITOR | GAIN | CHANNEL 3 | VOLUME | MONITOR | GAIN | MIX | SEND VOLUME | RETURN GAIN | OUT VOLUME | RIGHT GAIN | LEFT GAIN